# Altium schematic sheet Sheet1.SchDoc
size A4
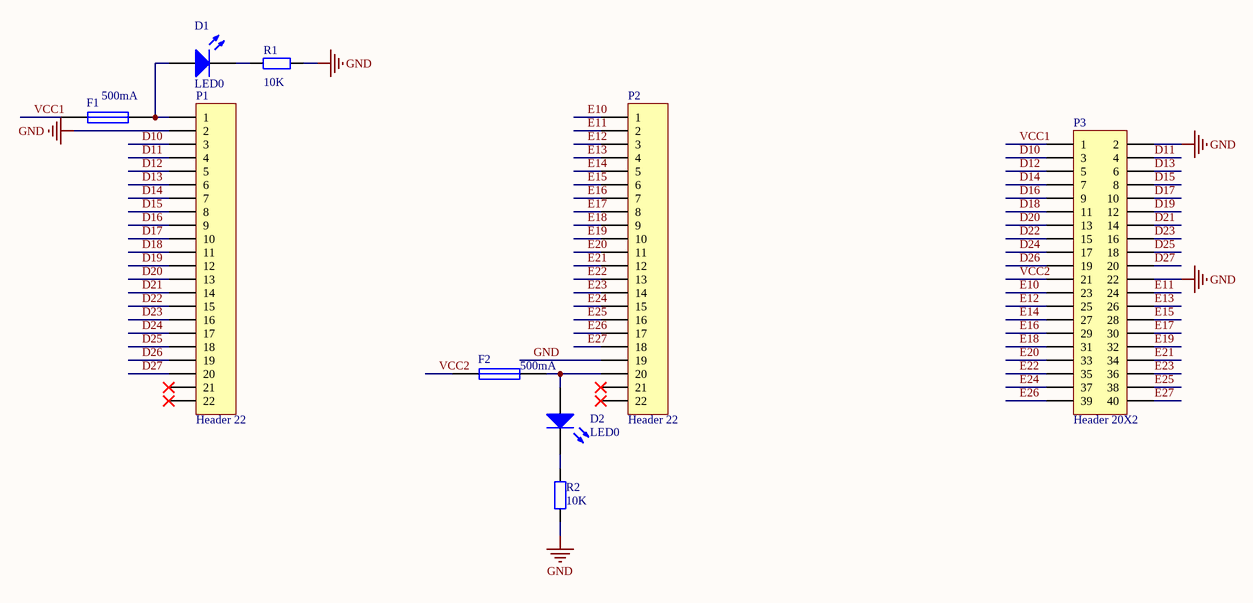
[diagram p0: Sheet1.SchDoc]

## Parts
D1  LED0  [LED0805绿]
D2  LED0  [LED0805绿]
F1  500mA  [R0805]
F2  500mA  [R0805]
P1  Header 22  [FPC20Pin]
P2  Header 22  [FPC20Pin]
P3  Header 20X2  [BTB0.8con40Pin]
R1  value 10K  [R0805]  (hidden comment: Res2)
R2  value 10K  [R0805]  (hidden comment: Res2)

## Nets
GND: P1.2 P2.19 P3.2 P3.22 R1.2 R2.1
D10: P1.3 P3.3
D11: P1.4 P3.4
D12: P1.5 P3.5
D13: P1.6 P3.6
D14: P1.7 P3.7
D15: P1.8 P3.8
D16: P1.9 P3.9
D17: P1.10 P3.10
D18: P1.11 P3.11
D19: P1.12 P3.12
D20: P1.13 P3.13
D21: P1.14 P3.14
D22: P1.15 P3.15
D23: P1.16 P3.16
D24: P1.17 P3.17
D25: P1.18 P3.18
D26: P1.19 P3.19
D27: P1.20 P3.20
E10: P2.1 P3.23
E11: P2.2 P3.24
E12: P2.3 P3.25
E13: P2.4 P3.26
E14: P2.5 P3.27
E15: P2.6 P3.28
E16: P2.7 P3.29
E17: P2.8 P3.30
E18: P2.9 P3.31
E19: P2.10 P3.32
E20: P2.11 P3.33
E21: P2.12 P3.34
E22: P2.13 P3.35
E23: P2.14 P3.36
E24: P2.15 P3.37
E25: P2.16 P3.38
E26: P2.17 P3.39
E27: P2.18 P3.40
VCC1: F1.1 P3.1
VCC2: F2.1 P3.21
NetD1_1: D1.1(A) F1.2 P1.1
NetD1_2: D1.2(K) R1.1
NetD2_1: D2.1(A) F2.2 P2.20
NetD2_2: D2.2(K) R2.2

Not connected (* = marked no-connect by the designer): P1 21* 22*; P2 21* 22*

## Library data of the parts
D1 D2 = LED0: Typical INFRARED GaAs LED; Published: 8-Jun-2000; LatestRevisionDate: 08-Jul-2005; LatestRevisionNote: Mech Layer 1 removed.; PackageReference: LED-0; Publisher: Altium Limited; PackageDescription: LED; 2 Leads
F1 F2 = Fuse 1: Fuse; Published: 8-Jun-2000; LatestRevisionDate: 17-Jul-2002; LatestRevisionNote: Re-released for DXP Platform.; PackageReference: PIN-W2/E2.8; Publisher: Altium Limited; PackageDescription: Thru-Hole; 2 Leads
P1 P2 = Header 22: Header, 22-Pin; LatestRevisionDate: 17-Jul-2002; LatestRevisionNote: Re-released for DXP Platform.; Publisher: Altium Limited
P3 = Header 20X2: Header, 20-Pin, Dual row; LatestRevisionDate: 17-Jul-2002; LatestRevisionNote: Re-released for DXP Platform.; Publisher: Altium Limited
R1 R2 = Res2: Resistor; Published: 8-Jun-2000; LatestRevisionDate: 17-Jul-2002; LatestRevisionNote: Re-released for DXP Platform.; PackageReference: AXIAL-0.4; Publisher: Altium Limited; PackageDescription: Axial Device, Thru-Hole; 2 Leads; 0.4 in Pin Spacing